# Altium schematic sheet LM317-LM337 - 改.SchDoc
size A4
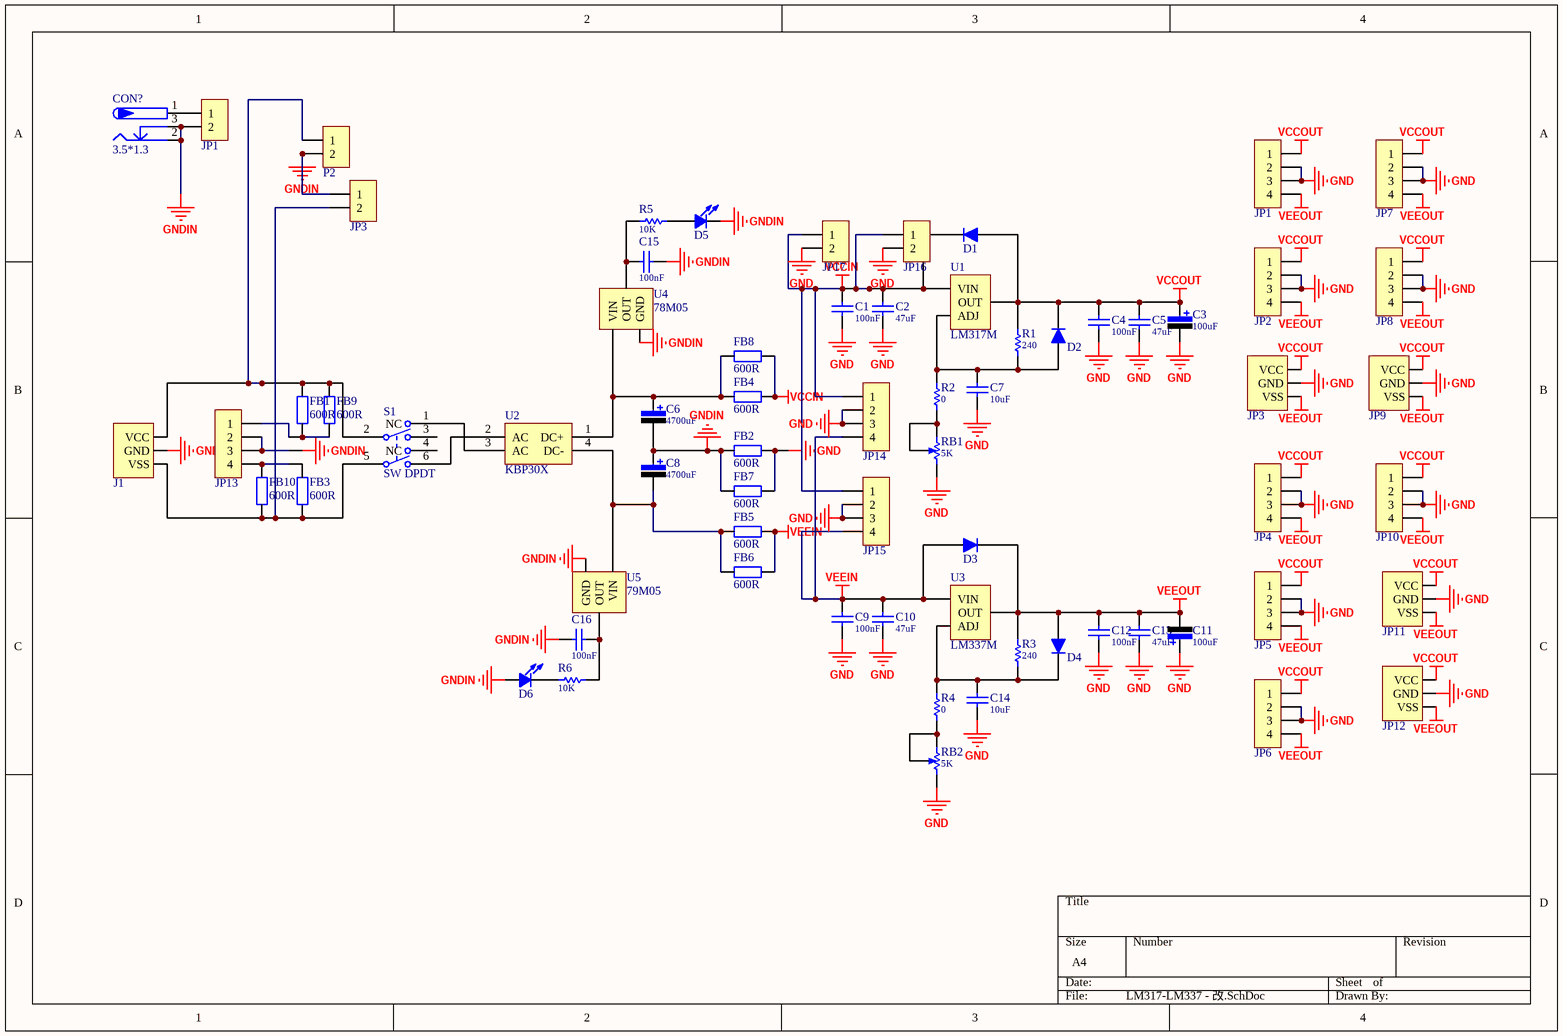
[diagram p0: LM317-LM337 - 改.SchDoc]

## Parts
(Parts that share a designator on the sheet are numbered #1, #2 ... from top to bottom, then left to right.)
C1  value 100nF  [C0603-L]  (hidden comment: Cap-S)
C2  value 47uF  [C0805-L]  (hidden comment: Cap-S)
C3  value 100uF  [C-DIP-10]  (hidden comment: C)
C4  value 100nF  [C0603-L]  (hidden comment: Cap-S)
C5  value 47uF  [C0805-L]  (hidden comment: Cap-S)
C6  value 4700uF  [C-DIP-20]  (hidden comment: C)
C7  value 10uF  [C0603-L]  (hidden comment: Cap-S)
C8  value 4700uF  [C-DIP-20]  (hidden comment: C)
C9  value 100nF  [C0603-L]  (hidden comment: Cap-S)
C10  value 47uF  [C0805-L]  (hidden comment: Cap-S)
C11  value 100uF  [C-DIP-10]  (hidden comment: C)
C12  value 100nF  [C0603-L]  (hidden comment: Cap-S)
C13  value 47uF  [C0805-L]  (hidden comment: Cap-S)
C14  value 10uF  [C0603-L]  (hidden comment: Cap-S)
C15  value 100nF  [C0603-L]  (hidden comment: Cap-S)
C16  value 100nF  [C0603-L]  (hidden comment: Cap-S)
CON?  3.5*1.3  [DC-005]
D1  D  [D-SMA]  (value not drawn)
D2  D  [D-SMA]  (value not drawn)
D3  D  [D-SMA]  (value not drawn)
D4  D  [D-SMA]  (value not drawn)
D5  LED  [Led-0805_L]  (value not drawn)
D6  LED  [Led-0805_L]  (value not drawn)
FB1  600R  [FB-0805]
FB2  600R  [FB-0805]
FB3  600R  [FB-0805]
FB4  600R  [FB-0805]
FB5  600R  [FB-0805]
FB6  600R  [FB-0805]
FB7  600R  [FB-0805]
FB8  600R  [FB-0805]
FB9  600R  [FB-0805]
FB10  600R  [FB-0805]
J1  接线座-3P  [KF128-5.08-3P]  (value not drawn)
JP1#1  HDR-1X2  [VH3.96-LI-2P]  (value not drawn)
JP1#2  HDR-1X4  [VH3.96-LI-4P]  (value not drawn)
JP2  HDR-1X4  [VH3.96-LI-4P]  (value not drawn)
JP3#1  HDR-1X2  [VH3.96-LI-2P]  (value not drawn)
JP3#2  接线座-3P  [KF128-5.08-3P]  (value not drawn)
JP4  HDR-1X4  [VH3.96-LI-4P]  (value not drawn)
JP5  HDR-1X4  [VH3.96-LI-4P]  (value not drawn)
JP6  HDR-1X4  [VH3.96-LI-4P]  (value not drawn)
JP7  HDR-1X4  [VH3.96-LI-4P]  (value not drawn)
JP8  HDR-1X4  [VH3.96-LI-4P]  (value not drawn)
JP9  接线座-3P  [KF128-5.08-3P]  (value not drawn)
JP10  HDR-1X4  [VH3.96-LI-4P]  (value not drawn)
JP11  接线座-3P  [KF128-5.08-3P]  (value not drawn)
JP12  接线座-3P  [KF128-5.08-3P]  (value not drawn)
JP13  HDR-1X4  [VH3.96-LI-4P]  (value not drawn)
JP14  HDR-1X4  [VH3.96-LI-4P]  (value not drawn)
JP15  HDR-1X4  [VH3.96-LI-4P]  (value not drawn)
JP16  HDR-1X2  [VH3.96-LI-2P]  (value not drawn)
JP17  HDR-1X2  [VH3.96-LI-2P]  (value not drawn)
P2  HDR-1X2  [VH3.96-LI-2P]  (value not drawn)
R1  value 240  [R0603-L]  (hidden comment: R)
R2  value 0  [R0603-L]  (hidden comment: R)
R3  value 240  [R0603-L]  (hidden comment: R)
R4  value 0  [R0603-L]  (hidden comment: R)
R5  value 10K  [R0603-L]  (hidden comment: R)
R6  value 10K  [R0603-L]  (hidden comment: R)
RB1  value 5K  [R_VR-3296W]  (hidden comment: R)
RB2  value 5K  [R_VR-3296W]  (hidden comment: R)
S1  SW DPDT  [SW_DPDT]
U1  LM317M  [TO-263-2]
U2  KBP30X  [Bridge]
U3  LM337M  [TO-263-2]
U4  78M05  [TO-252]
U5  79M05  [TO-252]

## Nets
GND: C1.1 C2.1 C3.2 C4.1 C5.1 C7.1 C9.1 C10.1 C11.1 C12.1 C13.1 C14.1 FB2.2 FB7.2 JP1#2.2 JP1#2.3 JP2.2 JP2.3 JP3#2.2(GND) JP4.2 JP4.3 JP5.2 JP5.3 JP6.2 JP6.3 JP7.2 JP7.3 JP8.2 JP8.3 JP9.2(GND) JP10.2 JP10.3 JP11.2(GND) JP12.2(GND) JP14.2 JP14.3 JP15.2 JP15.3 JP16.2 JP17.2 RB1.1 RB2.1
GNDIN: C6.2 C8.1 C15.1 C16.1 CON?.2 CON?.3 D5.2 D6.1 FB2.1 FB7.1 J1.2(GND) JP1#1.2 JP3#1.1 JP13.2 JP13.3 P2.2 U4.2(GND) U5.1(GND)
VCCIN: C1.2 C2.2 D1.2 FB4.2 FB8.2 JP14.1 JP15.1 JP16.1 JP17.1 U1.3(VIN)
VCCOUT: C3.1 C4.2 C5.2 D1.1 D2.2 JP1#2.1 JP2.1 JP3#2.1(VCC) JP4.1 JP5.1 JP6.1 JP7.1 JP8.1 JP9.1(VCC) JP10.1 JP11.1(VCC) JP12.1(VCC) R1.1 U1.2(OUT)
VEEIN: C9.2 C10.2 D3.1 FB5.2 FB6.2 JP14.4 JP15.4 U3.2(VIN)
VEEOUT: C11.2 C12.2 C13.2 D3.2 D4.1 JP1#2.4 JP2.4 JP3#2.3(VSS) JP4.4 JP5.4 JP6.4 JP7.4 JP8.4 JP9.3(VSS) JP10.4 JP11.3(VSS) JP12.3(VSS) R3.1 U3.3(OUT)
NetC6_1: C6.1 FB4.1 FB8.1 U2.1(DC+) U4.1(VIN)
NetC7_2: C7.2 D2.1 R1.2 R2.1 U1.1(ADJ)
NetC8_2: C8.2 FB5.1 FB6.1 U2.4(DC-) U5.2(VIN)
NetC14_2: C14.2 D4.2 R3.2 R4.1 U3.1(ADJ)
NetC15_2: C15.2 R5.1 U4.3(OUT)
NetC16_2: C16.2 R6.2 U5.3(OUT)
NetCON?_1: CON?.1 JP1#1.1
NetD5_1: D5.1 R5.2
NetD6_2: D6.2 R6.1
NetFB1_1: FB1.1 FB9.1 JP13.1
NetFB1_2: FB1.2 FB9.2 J1.1(VCC) P2.1 S1.2
NetFB3_1: FB3.1 FB10.2 JP13.4
NetFB3_2: FB3.2 FB10.1 J1.3(VSS) JP3#1.2 S1.5(COMMON2)
NetR2_2: R2.2 RB1.2 RB1.3
NetR4_2: R4.2 RB2.2 RB2.3
NetS1_1: S1.1(NC) U2.3(AC)
NetS1_6: S1.6(NO2) U2.2(AC)

Not connected (* = marked no-connect by the designer): S1 3(NO1) 4(NC)

## Library data of the parts
C1 C2 C4 C5 C7 C9 C10 C12-C16 = Cap-S: 贴片瓷片电容
C3 C6 C8 C11 = Cap-Pol-ER: 极性直插电解电容
CON? = P-DC: 低压电源接口; BOM名称: DC电源接口; 版权归属: 源创客; 学习资源: www.ooocke.com
D1-D4 = Diode: 二极管
D5 D6 = LED: 发光二极管
FB1-FB10 = FB
JP1#1 JP3#1 JP16 JP17 P2 = Header 2: 2P接插件; 版权归属: 源创客; BOM名称: 2P接插件; 学习资源: www.ooocke.com
JP1#2 JP2 JP4-JP8 JP10 JP13-JP15 = Header 4: 4P接插件; 版权归属: 源创客; BOM名称: 4P接插件; 学习资源: www.ooocke.com
R1-R6 = Res: 贴片电阻
RB1 RB2 = Res_Val: 可调电阻
S1 = SW DPDT: 自锁开关; Published: 24-Mar-1999; LatestRevisionDate: 29-May-2009; LatestRevisionNote: IPC-7351 Footprint Added.; PackageVersion: Mar-2001; PackageReference: SOT23-6; Publisher: Altium Limited; PackageDescription: 6-Pin SOT-23 Package 0.95 mm Pitch, 2.7 mm Lead Span; Code_JEITA: SC-74; Code_IPC: SOT26A-6
U2 = Bridge